# Altium schematic sheet Channel_input.SchDoc
size A4; SheetNumber: 2; SheetTotal: 5
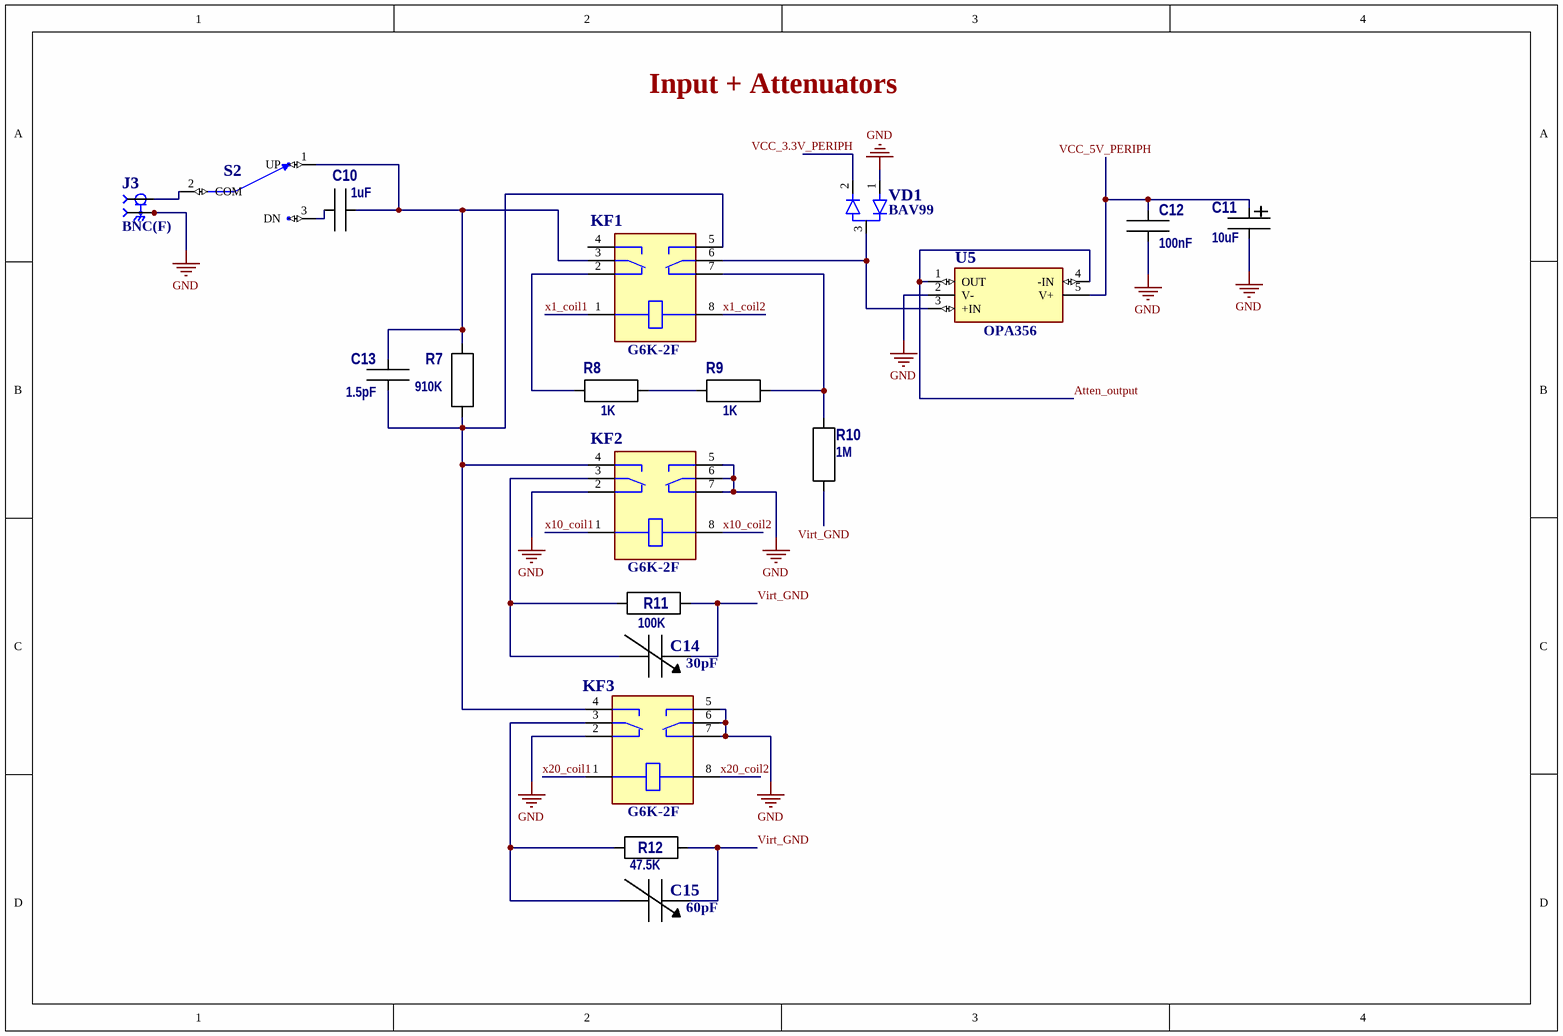
[diagram p0: Channel_input.SchDoc]

## Parts
C10  1uF  [C__s 5-d 5.5-t4]
C11  10uF  [Tant B]
C12  100nF  [CAP 0603 3D]
C13  1.5pF  [CAP 0603 3D]
C14  30pF  [Cvar]
C15  60pF  [Cvar]
J3  BNC(F)  [SAMTEC_BNC7T-J-P-XX-RA-BH1]
KF1  G6K-2F  [RELAY_G6K-2F]
KF2  G6K-2F  [RELAY_G6K-2F]
KF3  G6K-2F  [RELAY_G6K-2F]
R7  910K  [Res_1206 3D]
R8  1K  [Res_1206 3D]
R9  1K  [Res_1206 3D]
R10  1M  [Res_1206 3D]
R11  100K  [Res_1206 3D]
R12  47.5K  [Res_1206 3D]
S2  100SP1T1B1M7QE  [100SP1T1B1M7QE]  (value not drawn)
U5  OPA356  [SOT95P280X145-5N]
VD1  BAV99  [DIO_BAV99]

## Nets
GND: C11.2(-) C12.2 J3.S1 J3.S2 J3.S3 J3.S4 KF2.2 KF2.5 KF2.6 KF2.7 KF3.2 KF3.5 KF3.6 KF3.7 U5.2(V-) VD1.1
Atten_output: U5.1(OUT) U5.4(-IN)
VCC_3.3V_PERIPH: VD1.2
VCC_5V_PERIPH: C11.1(+) C12.1 U5.5(V+)
Virt_GND: C14.1 C15.1 R10.1 R11.2 R12.2
x1_coil1: KF1.1
x1_coil2: KF1.8
x10_coil1: KF2.1
x10_coil2: KF2.8
x20_coil1: KF3.1
x20_coil2: KF3.8
NetC10_1: C10.1 C13.2 KF1.3 R7.2 S2.1(UP)
NetC10_2: C10.2 S2.3(DN)
NetC13_1: C13.1 KF1.5 KF2.4 KF3.4 R7.1
NetC14_2: C14.2 KF2.3 R11.1
NetC15_2: C15.2 KF3.3 R12.1
NetJ3_1: J3.1 S2.2(COM)
NetKF1_2: KF1.2 R8.2
NetKF1_6: KF1.6 U5.3(+IN) VD1.3
NetKF1_7: KF1.7 R9.1 R10.2
NetR8_1: R8.1 R9.2

Not connected (* = marked no-connect by the designer): KF1 4

## Notes on the sheet
- Input + Attenuators

## Library data of the parts
C10 = C_Disk: Конденсатор керамика
C11 = C T: SMD type B 10 uF min 16V
C12 = C: 0603 100nF X7R
C13 = C: 0603 1.5pF X7R
C14 C15 = Сvar
J3 = BNC7T-J-P-XX-RA-BH1: Connecteur BNC Jack, Embase femelle 75Ohm Montage sur panneau, Traversant, Soudure Ã  angle droit; MP: BNC7T-J-P-HN-RA-BH1; MF: Samtec; Check_prices: https://www.snapeda.com/parts/BNC7T-J-P-HN-RA-BH1/Samtec+Inc./view-part/?ref=eda; Value: *; Availability: In Stock; Price: None; Package: None; SnapEDA_Link: https://www.snapeda.com/parts/BNC7T-J-P-HN-RA-BH1/Samtec+Inc./view-part/?ref=snap; Purchase-URL: https://pricing.snapeda.com/search/part/BNC7T-J-P-HN-RA-BH1/?ref=eda
KF1-KF3 = G6K-2F: Telecom Relay DPDT (2 Form C) Surface Mount; MF: Omron; SnapEDA_Link: https://www.snapeda.com/parts/G6K-2F/Omron/view-part/?ref=snap; Package: TDFN-6 Omron Electronics; Value: *; MP: G6K-2F; Check_prices: https://www.snapeda.com/parts/G6K-2F/Omron/view-part/?ref=eda
R7 = R: 1206 910K
R8 R9 = R: 1 KOhm 1206
R10 = R: 1 MOhm 1206
R11 = R: 100 KOhm 1206
R12 = R: 47.5 KOhm 1206
S2 = 100SP1T1B1M7QE: TOGGLE, 5A, 120VAC/28VDC SPDT, On-On, Panel Mount, Right Angle, Vertical; MF: E-Switch; SnapEDA_Link: https://www.snapeda.com/parts/100SP1T1B1M7QE/E-Switch/view-part/?ref=snap; Package: None; Value: *; MP: 100SP1T1B1M7QE; Check_prices: https://www.snapeda.com/parts/100SP1T1B1M7QE/E-Switch/view-part/?ref=eda
U5 = OPA356AIDBVR: 2.5V, 200MHz GBW, CMOS Single Op Amp; MF: Texas Instruments; SnapEDA_Link: https://www.snapeda.com/parts/OPA356AIDBVR/Texas+Instruments/view-part/?ref=snap; Package: SOT-23-5 Texas Instruments; Value: *; MP: OPA356AIDBVR; Check_prices: https://www.snapeda.com/parts/OPA356AIDBVR/Texas+Instruments/view-part/?ref=eda
VD1 = BAV99: Diode Array 1 Pair Series Connection Standard 100V 215mA (DC) Surface Mount TO-236-3, SC-59, SOT-23-3; MF: ON Semiconductor; Price: None; Availability: In Stock; MP: BAV99; Package: SOT-23-3 Motorola; SnapEDA_Link: https://www.snapeda.com/parts/BAV99/Onsemi/view-part/?ref=snap; Check_prices: https://www.snapeda.com/parts/BAV99/Onsemi/view-part/?ref=eda; Value: *; Purchase-URL: https://pricing.snapeda.com/search/part/BAV99/?ref=eda